# Altium schematic sheet 07-PowerManagement.SchDoc: Power Management
size A2; DocumentNumber: 7; SheetNumber: 7; SheetTotal: 15
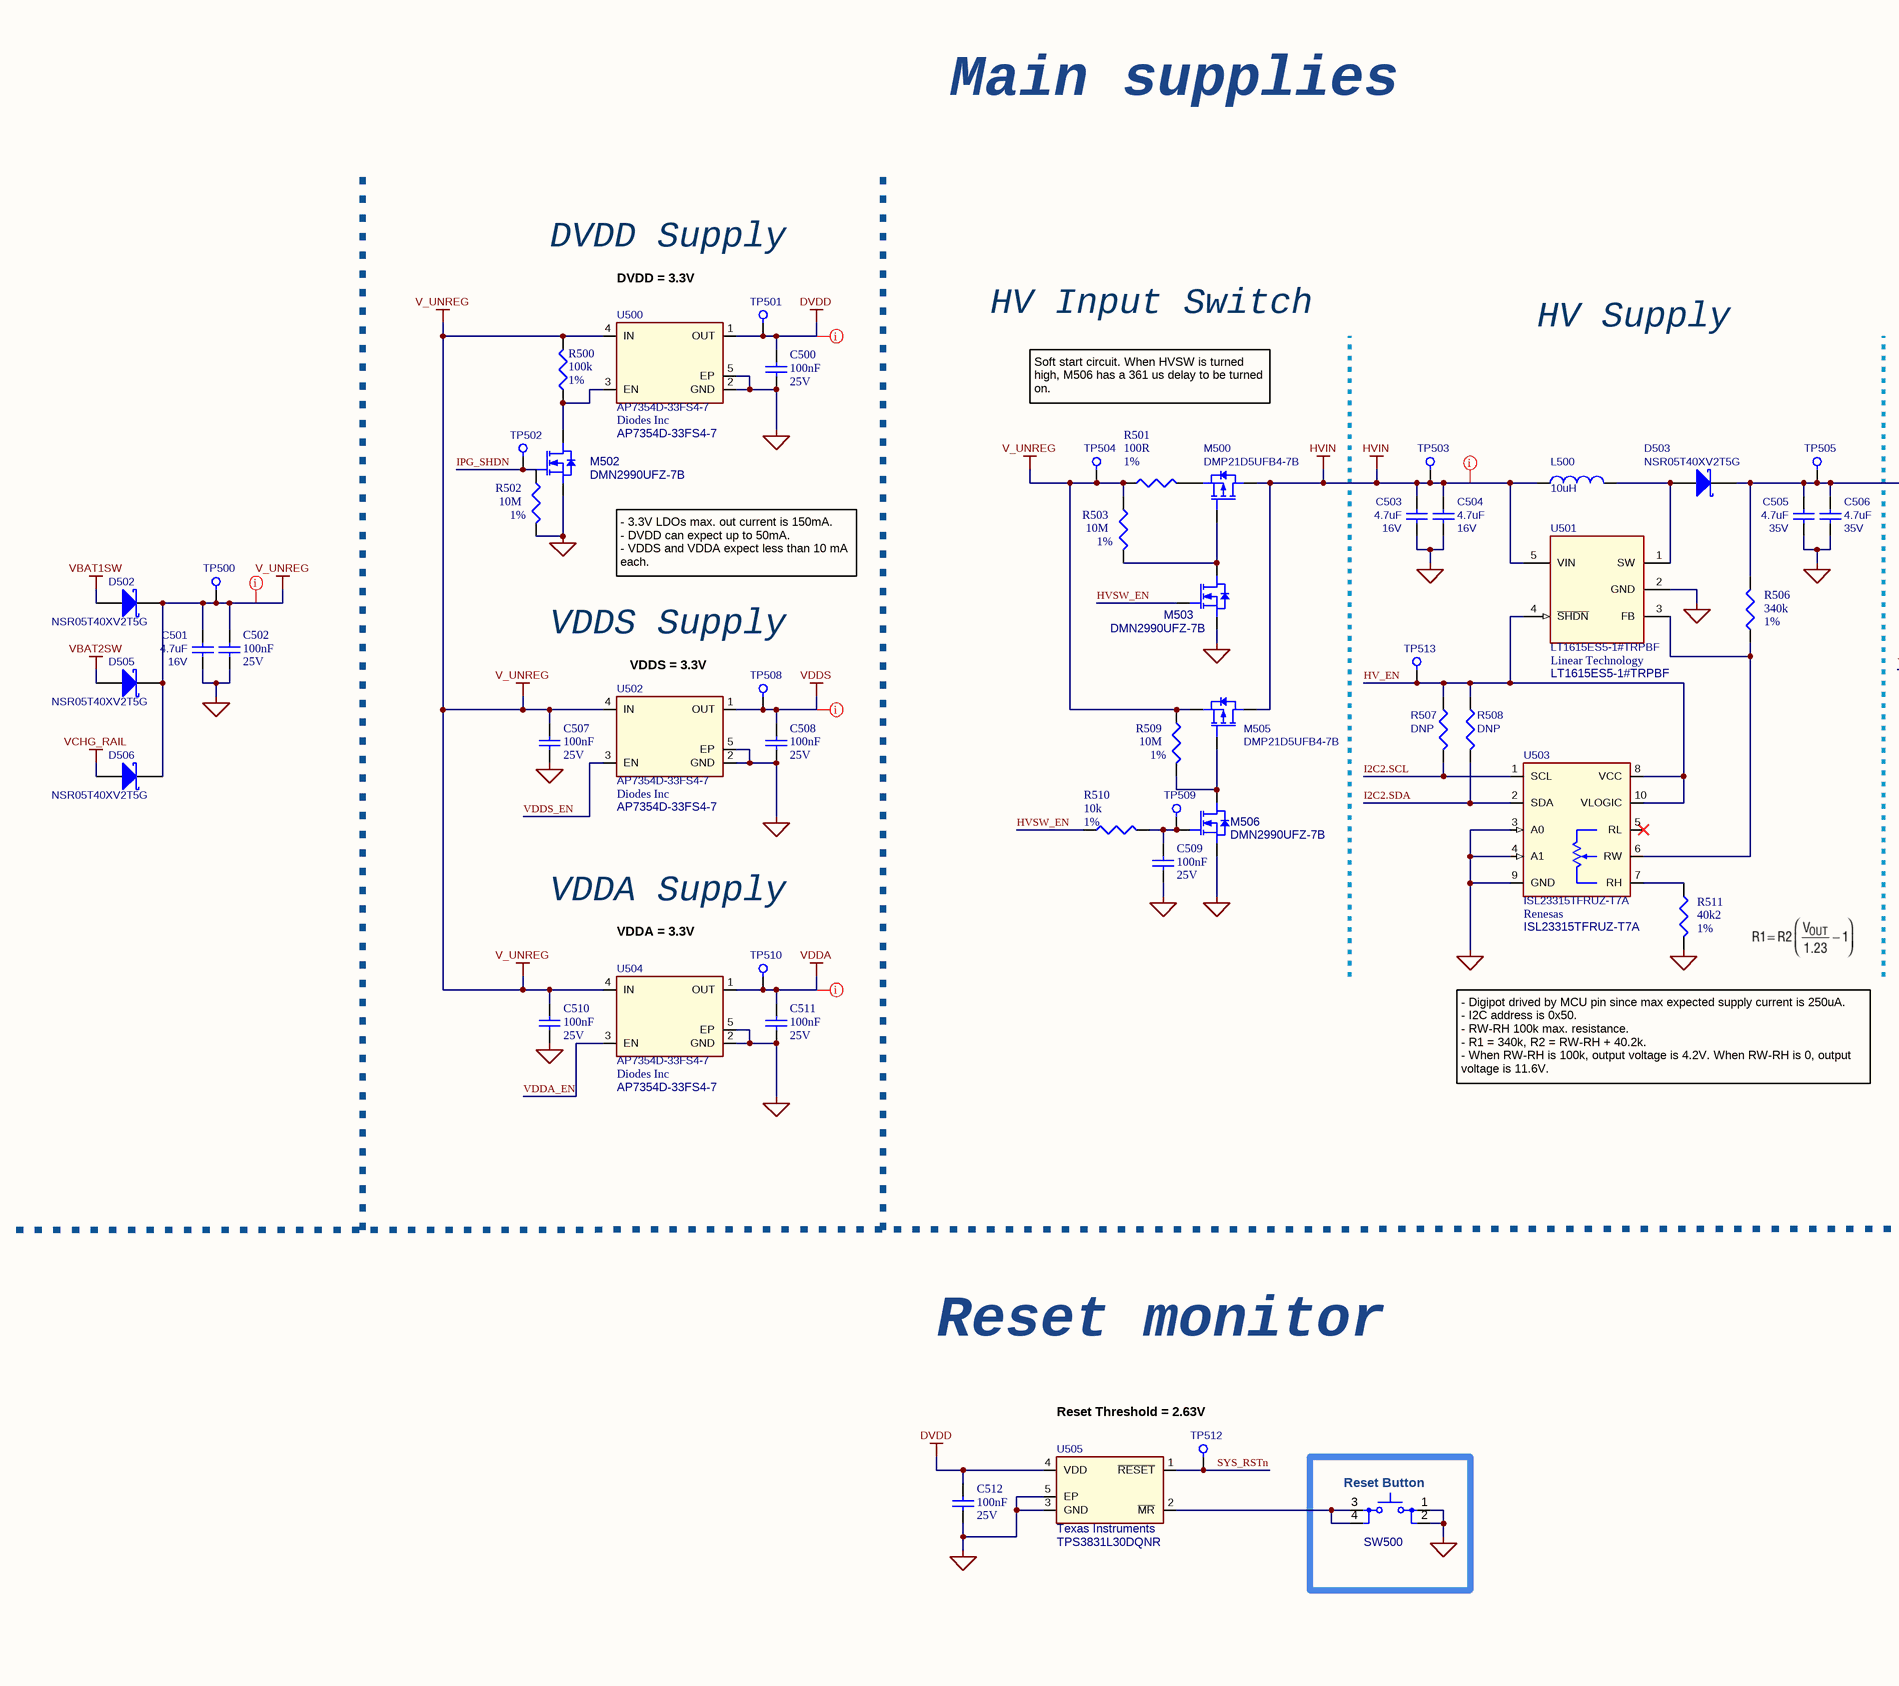
[diagram p0: 07-PowerManagement.SchDoc, left]
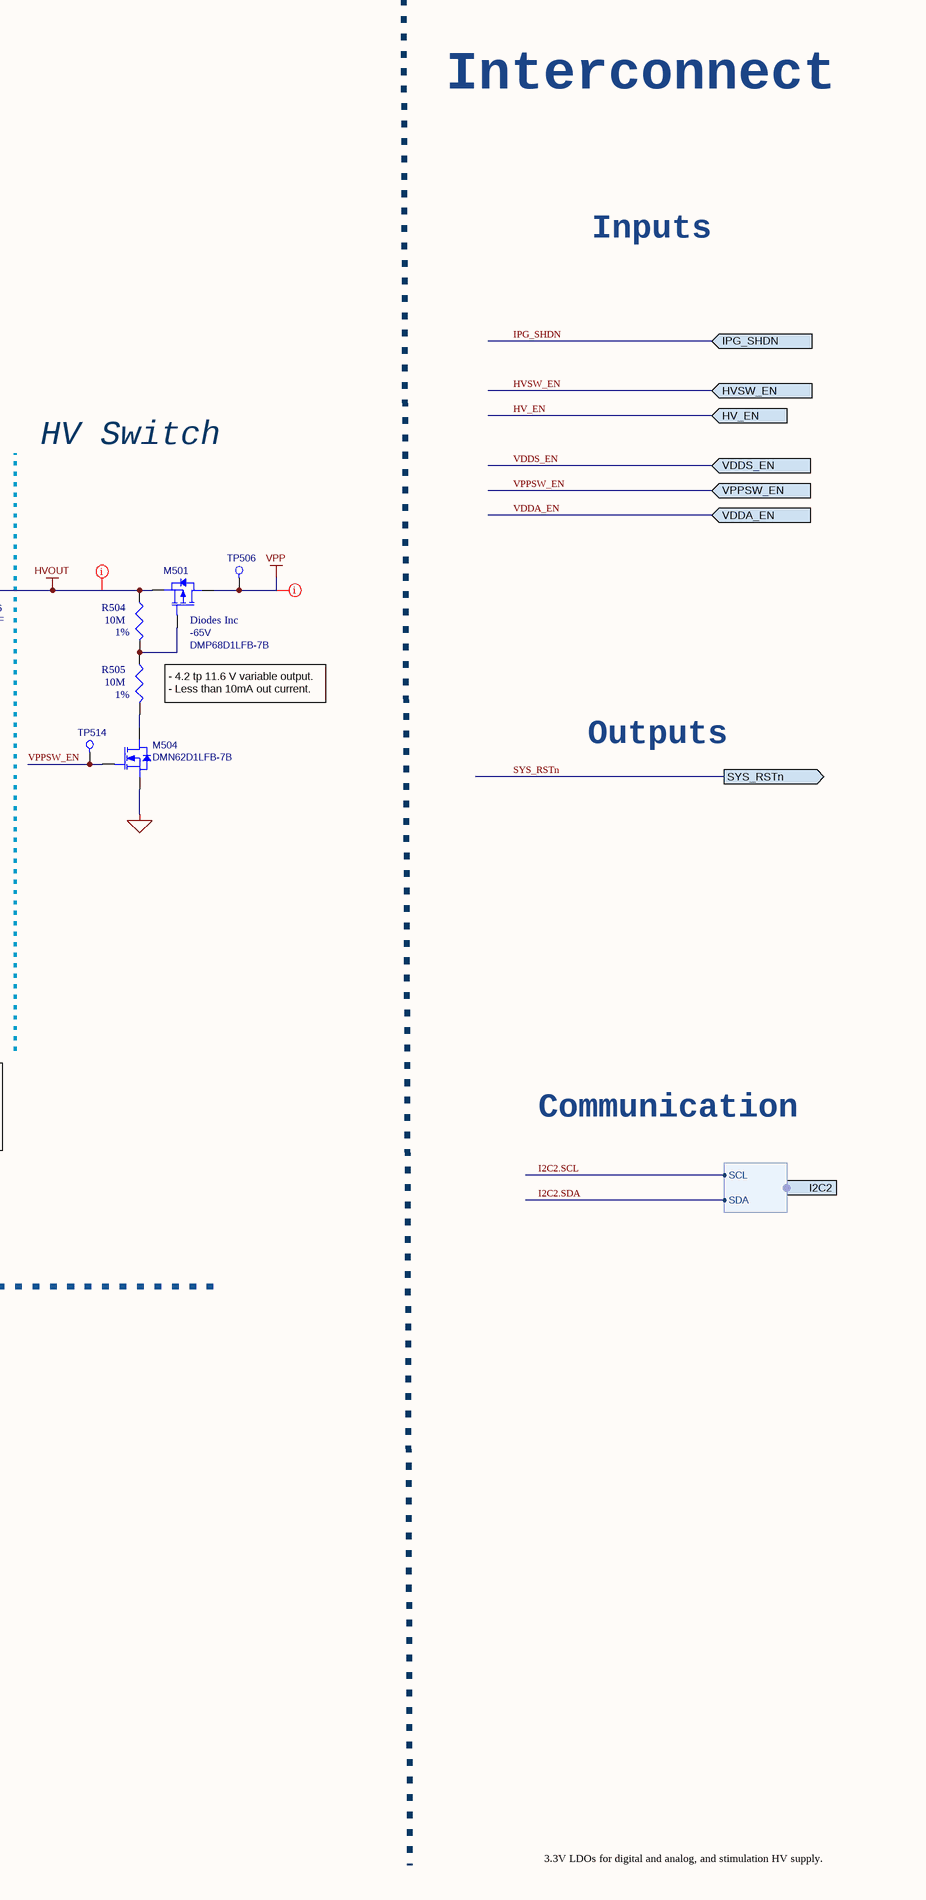
[diagram p1: 07-PowerManagement.SchDoc, right]

## Parts
C500  value 100nF  Rated DC Voltage (URdc): 25V  [C0201_C]  (hidden comment: GRM033R61E104KE14J)
C501  value 4.7uF  Rating: 16V  [CAP0603_REDUCED]  (hidden comment: GRM188R61C475KE11)
C502  value 100nF  Rated DC Voltage (URdc): 25V  [C0201_C]  (hidden comment: GRM033R61E104KE14J)
C503  value 4.7uF  Rating: 16V  [CAP0603_REDUCED]  (hidden comment: GRM188R61C475KE11)
C504  value 4.7uF  Rating: 16V  [CAP0603_REDUCED]  (hidden comment: GRM188R61C475KE11)
C505  value 4.7uF  Rating: 35V  [CAP0805_REDUCED]  (hidden comment: GCM21BC7YA475KE36L)
C506  value 4.7uF  Rating: 35V  [CAP0805_REDUCED]  (hidden comment: GCM21BC7YA475KE36L)
C507  value 100nF  Rated DC Voltage (URdc): 25V  [C0201_C]  (hidden comment: GRM033R61E104KE14J)
C508  value 100nF  Rated DC Voltage (URdc): 25V  [C0201_C]  (hidden comment: GRM033R61E104KE14J)
C509  value 100nF  Rated DC Voltage (URdc): 25V  [C0201_C]  (hidden comment: GRM033R61E104KE14J)
C510  value 100nF  Rated DC Voltage (URdc): 25V  [C0201_C]  (hidden comment: GRM033R61E104KE14J)
C511  value 100nF  Rated DC Voltage (URdc): 25V  [C0201_C]  (hidden comment: GRM033R61E104KE14J)
C512  value 100nF  Rated DC Voltage (URdc): 25V  [C0201_C]  (hidden comment: GRM033R61E104KE14J)
D502  NSR05T40XV2T5G  [STM_SOD-523_R]
D503  NSR05T40XV2T5G  [STM_SOD-523_R]
D505  NSR05T40XV2T5G  [STM_SOD-523_R]
D506  NSR05T40XV2T5G  [STM_SOD-523_R]
L500  value 10uH  [WURTH_74438323100_REDUCED]  (hidden comment: 74438323100)
M500  DMP21D5UFB4-7B  [DIODESINC_X2-DFN1006-3_REDUCED]
M501  Manufacturer: Diodes Inc  Rating: -65V  [DIODESINC_X1-DFN1006-3]  (hidden comment: DMP68D1LFB-7B)
M502  DMN2990UFZ-7B  [DIODESINC_X2-DFN0606-3]
M503  DMN2990UFZ-7B  [DIODESINC_X2-DFN0606-3]
M504  DMN62D1LFB-7B  [DIODESINC_X1-DFN1006-3]
M505  DMP21D5UFB4-7B  [DIODESINC_X2-DFN1006-3_REDUCED]
M506  DMN2990UFZ-7B  [DIODESINC_X2-DFN0606-3]
R500  value 100k  Tolerance: 1%  [R0201_C]  (hidden comment: CRCW0201100KFNED)
R501  value 100R  Tolerance: 1%  [R0201_C]  (hidden comment: CRCW0201100RFNED)
R502  value 10M  Tolerance: 1%  [R0201_C]  (hidden comment: CRCW020110M0FNED)
R503  value 10M  Tolerance: 1%  [R0201_C]  (hidden comment: CRCW020110M0FNED)
R504  value 10M  Tolerance: 1%  [R0201_C]  (hidden comment: CRCW020110M0FNED)
R505  value 10M  Tolerance: 1%  [R0201_C]  (hidden comment: CRCW020110M0FNED)
R506  value 340k  Tolerance: 1%  [R0201_C]  (hidden comment: CRCW0201340KFKED)
R507  value DNP  [RES0402_REDUCED]  (hidden comment: Resistor, DNP, 0402)
R508  value DNP  [RES0402_REDUCED]  (hidden comment: Resistor, DNP, 0402)
R509  value 10M  Tolerance: 1%  [R0201_C]  (hidden comment: CRCW020110M0FNED)
R510  value 10k  Tolerance: 1%  [R0201_C]  (hidden comment: CRCW020110K0FNED)
R511  value 40k2  Tolerance: 1%  [R0201_C]  (hidden comment: CRCW020140K2FNED)
SW500  PB  [CK_PTS647]  (value not drawn)
TP500  Test Point  [testpad_0.9mm]  (value not drawn)  (no BOM)
TP501  Test Point  [testpad_0.9mm]  (value not drawn)  (no BOM)
TP502  Test Point  [testpad_0.9mm]  (value not drawn)  (no BOM)
TP503  Test Point  [testpad_0.9mm]  (value not drawn)  (no BOM)
TP504  Test Point  [testpad_0.9mm]  (value not drawn)  (no BOM)
TP505  Test Point  [testpad_0.9mm]  (value not drawn)  (no BOM)
TP506  Test Point  [testpad_0.9mm]  (value not drawn)  (no BOM)
TP508  Test Point  [testpad_0.9mm]  (value not drawn)  (no BOM)
TP509  Test Point  [testpad_0.9mm]  (value not drawn)  (no BOM)
TP510  Test Point  [testpad_0.9mm]  (value not drawn)  (no BOM)
TP512  Test Point  [testpad_0.9mm]  (value not drawn)  (no BOM)
TP513  Test Point  [testpad_0.9mm]  (value not drawn)  (no BOM)
TP514  Test Point  [testpad_0.9mm]  (value not drawn)  (no BOM)
U500  AP7354D-33FS4-7  Manufacturer: Diodes Inc  [X2-DFN1010-4 (Type B)]
U501  LT1615ES5-1#TRPBF  Manufacturer: Linear Technology  [LT_S5_L]
U502  AP7354D-33FS4-7  Manufacturer: Diodes Inc  [X2-DFN1010-4 (Type B)]
U503  ISL23315TFRUZ-T7A  Manufacturer: Renesas  [RENESAS_L10.2.1X1.6A_UTQFN10]
U504  AP7354D-33FS4-7  Manufacturer: Diodes Inc  [X2-DFN1010-4 (Type B)]
U505  Manufacturer: Texas Instruments  [TI_X2SON_DQN0004A]  (hidden comment: TPS3831L30DQNR)

## Ports
HV_EN (in), HVSW_EN (in), I2C2 (harness I2C), IPG_SHDN (in), SYS_RSTn (out), VDDA_EN (in), VDDS_EN (in), VPPSW_EN (in)

## Harnesses
I2C: SDA, SCL

## Nets
DVDD: C500.2 C512.2 TP501.1 U500.1(OUT) U505.4(VDD)
GND: C500.1 C501.2 C502.1 C503.2 C504.2 C505.2 C506.2 C507.1 C508.1 C509.1 C510.1 C511.1 C512.1 M502.2(S) M503.2(S) M504.2(S) M506.2(S) R502.2 R511.2 SW500.1 SW500.2 U500.2(GND) U500.5(EP) U501.2(GND) U502.2(GND) U502.5(EP) U503.3(A0) U503.4(A1) U503.9(GND) U504.2(GND) U504.5(EP) U505.3(GND) U505.5(EP)
HVIN: C503.1 C504.1 L500.1 M500.3(D) M505.3(D) TP503.1 U501.5(VIN)
HVOUT: C505.1 C506.1 D503.1(K) M501.2(S) R504.1 R506.2 TP505.1
V_UNREG: C501.1 C502.2 C507.2 C510.2 D502.1(K) D505.1(K) D506.1(K) M505.2(S) R500.2 R501.1 R503.1 R509.1 TP500.1 TP504.1 U500.4(IN) U502.4(IN) U504.4(IN)
VBAT1SW: D502.2(A)
VBAT2SW: D505.2(A)
VCHG_RAIL: D506.2(A)
VDDA: C511.2 TP510.1 U504.1(OUT)
VDDS: C508.2 TP508.1 U502.1(OUT)
VPP: M501.3(D) TP506.1
HV_EN: R507.1 R508.1 TP513.1 U501.4(~{SHDN}) U503.8(VCC) U503.10(VLOGIC) ; port HV_EN
HVSW_EN: M503.1(G) R510.1 ; port HVSW_EN
I2C2.SCL: R507.2 U503.1(SCL) ; port I2C2.SCL
I2C2.SDA: R508.2 U503.2(SDA) ; port I2C2.SDA
IPG_SHDN: M502.1(G) R502.1 TP502.1 ; port IPG_SHDN
SYS_RSTn: TP512.1 U505.1(~{RESET}) ; port SYS_RSTn
VDDA_EN: U504.3(EN) ; port VDDA_EN
VDDS_EN: U502.3(EN) ; port VDDS_EN
VPPSW_EN: M504.1(G) TP514.1 ; port VPPSW_EN
NetC509_2: C509.2 M506.1(G) R510.2 TP509.1
NetD503_2: D503.2(A) L500.2 U501.1(SW)
NetM500_1: M500.1(G) M503.3(D) R503.2
NetM500_2: M500.2(S) R501.2
NetM501_1: M501.1(G) R504.2 R505.1
NetM502_3: M502.3(D) R500.1 U500.3(EN)
NetM504_3: M504.3(D) R505.2
NetM505_1: M505.1(G) M506.3(D) R509.2
NetR506_1: R506.1 U501.3(FB) U503.6(RW)
NetR511_1: R511.1 U503.7(RH)
NetSW500_3: SW500.3 SW500.4 U505.2(~{MR})

Not connected (* = marked no-connect by the designer): U503 5(RL)*

## Layout directives
rule Supply Nets [Voltage = 3.300]; net class POWER: DVDD, VDDA, VDDS
Voltage: 4.2-11.6V: VPP
net class POWER; Voltage: 2.8-5.0V: HVIN, V_UNREG
net class POWER; Voltage: 4.2-11.6V: HVOUT

## Notes on the sheet
- Interconnect
- Main supplies
- Inputs
- DVDD Supply
- DVDD = 3.3V
- HV Input Switch
- HV Supply
- HV Switch
- Soft start circuit. When HVSW is turned high, M506 has a 361 us delay to be turned on.
- - 3.3V LDOs max. out current is 150mA.
  - DVDD can expect up to 50mA.
  - VDDS and VDDA expect less than 10 mA each.
- VDDS Supply
- - 4.2 tp 11.6 V variable output.
  - Less than 10mA out current.
- Outputs
- VDDS = 3.3V
- VDDA Supply
- VDDA = 3.3V
- Communication
- - Digipot drived by MCU pin since max expected supply current is 250uA.
  - I2C address is 0x50.
  - RW-RH 100k max. resistance.
  - R1 = 340k, R2 = RW-RH + 40.2k.
  - When RW-RH is 100k, output voltage is 4.2V. When RW-RH is 0, output voltage is 11.6V.
- Reset monitor
- Reset Threshold = 2.63V
- (near SW500) Reset Button
- 3.3V LDOs for digital and analog, and stimulation HV supply.
- Project:
- Schematic:
- Design by:
- Date:
- Ver:
- .
- Comments:
- Reviewed by:

## Library data of the parts
C500 C502 C507-C512 = GRM033R61E104KE14J: Ceramic Capacitor, Multilayer, Ceramic, 25V, 10% +Tol, 10% -Tol, X5R, 15% TC, 0.1uF, Surface Mount, 0201; Manufacturer: Murata; Multilayer: Yes; Category: Ceramic Capacitors; Supplier: Digikey; Supplier Part Number: 490-14571-1-ND; Manufacturer Part Number: GRM033R61E104KE14J; RoHS: Yes; Stock: 1540851; Pricing: 1=0,1, 10=0,033, 50=0,0192, 100=0,0148, 500=0,01118, 1000=0,00878, 2500=0,00798, 5000=0,00734 (USD); Mounting Technology: Surface Mount; Pins: 2; Dielectric Material: Ceramic; Package Shape: Rectangular; Case/Package: 0201; Terminal Finish: Nickel; Min Operating Temperature: -55°C; Max Operating Temperature: 85°C; JESD-609 Code: e3; Capacitor Type: Ceramic; Tolerance  (fill in as +-): 10%; Package Style: SMTMeter; Packaging: Tape and Reel; Tolerance (fill in as +-): 10%; Temperature Characteristics Code: X5R; Termination: Wraparound; Length: 0.6mm; Width: 0.3mm; Height: 0.3mm; Reach SVHC Compliant: Yes; RoHS Compliant: Yes; ComponentLink1URL: https://psearch.en.murata.com:443/capacitor/product/GRM033R61E104KE14%23.pdf?src-supplier=IHS+Markit; ComponentLink1Description: https://psearch.en.murata.com:443/capacitor/product/GRM033R61E104KE14%23.pdf?src-supplier=IHS+Markit; ComponentLink2URL: http://www.mouser.com/ds/2/281/c02e-2905.pdf?src-supplier=Mouser; ComponentLink2Description: http://www.mouser.com/ds/2/281/c02e-2905.pdf?src-supplier=Mouser; ComponentLink3URL: http://search.murata.co.jp/Ceramy/image/img/A01X/G101/ENG/GRM033R61E104KE14-01.pdf?src-supplier=Digikey; ComponentLink3Description: http://search.murata.co.jp/Ceramy/image/img/A01X/G101/ENG/GRM033R61E104KE14-01.pdf?src-supplier=Digikey; ComponentLink4URL: https://search.murata.co.jp/Ceramy/image/img/A01X/G101/ENG/GRM033R61E104KE14-01.pdf?src-supplier=Digikey; ComponentLink4Description: https://search.murata.co.jp/Ceramy/image/img/A01X/G101/ENG/GRM033R61E104KE14-01.pdf?src-supplier=Digikey; Supplier 1: Arrow Electronics; Supplier Part Number 1: GRM033R61E104KE14J
C501 C503 C504 = GRM188R61C475KE11: Capacitor, 4.7uF, X5R, 16V, 10%, 0603, Implant-grade; Manufacturer: Murata; Medical Grade MFR PN: GCH188R61C475KE11; Length (mm): 1.60 ±0.10; Medical Grade MFR: Murata; PCB Footprint: cap0603_reduced; Thickness (mm): 0.80 ±0.10; Width (mm): 0.80 ±0.10; Category: Capacitor; Package Description: 0603; Check: *; Supplier 1: Arrow Electronics; Supplier Part Number 1: GRM188R61C475KE11D; Status: *; Review: *; Manufacturer Part Number: GRM188R61C475KE11
C505 C506 = GCM21BC7YA475KE36L: Capacitor, 4.7uF, X7S, 35V, 10%, 0805, Implant-grade; Manufacturer: Murata; Medical Grade MFR PN: GCH21BC7YA475KE11; Review: 020823; Length (mm): 2.00 ±0.20; Medical Grade MFR: Murata; PCB Footprint: cap0805_reduced; Thickness (mm): 1.25 ±0.20; Width (mm): 1.25 ±0.20; Category: Capacitor; Package Description: 0805; Check: *; Supplier 1: Arrow Electronics; Supplier Part Number 1: GCM21BC7YA475KE36L; Status: Approved; Manufacturer Part Number: GCM21BC7YA475KE36L
D502 D503 D505 D506 = NSR05T40XV2T5G: Schottky, 40V, 500mA, 530mV, SOD-523; Manufacturer: ON Semiconductor; Medical Grade MFR: TBD; Review: 020823; Length (mm): 1.60 ±0.10; Medical Grade MFR PN: TBD; PCB Footprint: TBD; Rating: 40V, 500mA; Thickness (mm): 0.60 ±0.10; Value: NSR05T40XV2T5G; Width (mm): 0.80 ±0.10; Category: Diode; Supplier 1: Arrow Electronics; Supplier Part Number 1: NSR05T40XV2T5G; Status: Approved; Manufacturer Part Number: NSR05T40XV2T5G
L500 = 74438323100: Inductor, 10uH, 600mA, 20%, 1008; Manufacturer: Wurth; Medical Grade MFR: TBD; Review: 020823; Length (mm): 2.50 ±0.20; Medical Grade MFR PN: TBD; PCB Footprint: TBD; Rating: 600mA; Thickness (mm): 1.00; Width (mm): 2.00 ±0.20; Category: Inductor; Supplier 1: Rs; Supplier Part Number 1: 7922736P; Status: Approved; Manufacturer Part Number: 74438323100
M500 M505 = DMP21D5UFB4-7B: MOSFET, P-chan, -20V, -400mA, X2-DFN1006-3; Manufacturer: Diodes Inc; Medical Grade MFR: TBD; Review: 020823; Category: Transistor; Length (mm): 1.00 ±0.05; Medical Grade MFR PN: TBD; Rating: -20V; Thickness (mm): 0.40; Width (mm): 0.60 ±0.05; Value: DMP21D5UFB4-7B; Supplier 1: Digi-Key; Supplier Part Number 1: DMP21D5UFB4-7BDICT-ND; Status: Approved; Manufacturer Part Number: DMP21D5UFB4-7B
M501 = DMP68D1LFB-7B: MOSFET, P-chan, -65V, -290mA, DFN1006; Medical Grade MFR: TBD; Review: 020823; Category: Transistor; Length (mm): 1.00 ±0.08; Medical Grade MFR PN: TBD; PCB Footprint: DFN1006; Thickness (mm): 0.50 ±0.03; Width (mm): 0.60 ±0.08; Supplier 1: Mouser; Supplier Part Number 1: 621-DMP68D1LFB-7B; Value: DMP68D1LFB-7B; Manufacturer Part Number: DMP68D1LFB
M502 M503 M506 = DMN2990UFZ-7B: MOSFET, N-Chan, 20V, 170mA, DFN0606; Manufacturer: Diodes Inc; Medical Grade MFR: TBD; Review: 020823; Category: Transistor; Length (mm): 0.62 ±0.05; Medical Grade MFR PN: TBD; PCB Footprint: TBD; Rating: 20V; Thickness (mm): 0.38 ±0.02; Value: DMN2990UFZ-7B; Width (mm): 0.62 ±0.05; Supplier 1: Digi-Key; Supplier Part Number 1: DMN2990UFZ-7BDICT-ND; Status: Approved; Manufacturer Part Number: DMN2990UFZ-7B
M504 = DMN62D1LFB-7B: MOSFET, N-Chan, 60V, 320mA, DFN1006; Manufacturer: Diodes Inc; Medical Grade MFR: TBD; Review: 020823; Category: Transistor; Length (mm): 1.00 ±0.08; Medical Grade MFR PN: TBD; PCB Footprint: TBD; Rating: 60V; Thickness (mm): 0.50 ±0.03; Width (mm): 0.60 ±0.08; Value: DMN62D1LFB-7B; Supplier 1: Digi-Key; Supplier Part Number 1: DMN62D1LFB-7BDICT-ND; Status: Approved; Manufacturer Part Number: DMN62D1LFB-7B
R500 = CRCW0201100KFNED: Fixed Resistor, Metal Glaze/thick Film, 0.05W, 100000ohm, 30V, 1% +/-Tol, 200ppm/Cel, Surface Mount, 0201; Manufacturer: Vishay; Medical Grade MFR: Mini-Systems; Medical Grade MFR PN: MWA96SM-1003F-NS62TR; Power: 50mW; Rated Temperature: 70°C; Temperature Coefficient: 200ppm/°C; Package Height: 0.23mm; Package Length: 0.6mm; Package Width: 0.3mm; Reference Standard: AEC-Q200; Category: Chip SMD Resistors; Supplier: Digikey; Supplier Part Number: 541-100KABCT-ND; Manufacturer Part Number: CRCW0201100KFNED; RoHS: Yes; Stock: 8252; Pricing: 1=0,1, 10=0,037, 50=0,0242, 100=0,0204, 500=0,01426, 1000=0,01241, 5000=0,00924 (USD); Mounting Technology: Surface Mount; Pins: 2; Package Shape: Rectangular; Case/Package: 0201; Terminal Finish: Nickel; Min Operating Temperature: -55°C; Max Operating Temperature: 155°C; JESD-609 Code: e3; Resistor Type: FIXED RESISTOR; Construction: Chip; Package Style: SMTMeter; Packaging: Tape and Reel; Technology: METAL GLAZE/THICK FILM; Termination: Wraparound; Working Voltage: 30V; Reach SVHC Compliant: Yes; RoHS Compliant: Yes; ComponentLink1URL: https://datasheet.ciiva.com:443/pdfs/VipMasterIC/IC/VISH/VISH-S-A0002932828/VISH-S-A0002932828-1.pdf?src-supplier=IHS+Markit; ComponentLink1Description: https://datasheet.ciiva.com:443/pdfs/VipMasterIC/IC/VISH/VISH-S-A0002932828/VISH-S-A0002932828-1.pdf?src-supplier=IHS+Markit; ComponentLink2URL: https://datasheet.ciiva.com/2474/crcw0201e3-2474797.pdf?src-supplier=Digikey; ComponentLink2Description: https://datasheet.ciiva.com/2474/crcw0201e3-2474797.pdf?src-supplier=Digikey; ComponentLink3URL: https://datasheet.ciiva.com/2474/crcw0201e3-2474798.pdf?src-supplier=Digikey; ComponentLink3Description: https://datasheet.ciiva.com/2474/crcw0201e3-2474798.pdf?src-supplier=Digikey; ComponentLink4URL: https://datasheet.ciiva.com/2474/crcw0201e3-2474799.pdf?src-supplier=Digikey; ComponentLink4Description: https://datasheet.ciiva.com/2474/crcw0201e3-2474799.pdf?src-supplier=Digikey; ComponentLink5URL: https://datasheet.ciiva.com/16436/dcrcwe3-16436220.pdf?src-supplier=Future+Electronics; ComponentLink5Description: https://datasheet.ciiva.com/16436/dcrcwe3-16436220.pdf?src-supplier=Future+Electronics; ComponentLink6URL: https://datasheet.ciiva.com/28634/1847332-28634462.pdf?src-supplier=Element14; ComponentLink6Description: https://datasheet.ciiva.com/28634/1847332-28634462.pdf?src-supplier=Element14; ComponentLink7URL: https://datasheet.ciiva.com/22665/1700795-22665689.pdf?src-supplier=Element14; ComponentLink7Description: https://datasheet.ciiva.com/22665/1700795-22665689.pdf?src-supplier=Element14; ComponentLink8URL: https://datasheet.ciiva.com/22870/70202042-22870476.pdf?src-supplier=Allied+Electronics; ComponentLink8Description: https://datasheet.ciiva.com/22870/70202042-22870476.pdf?src-supplier=Allied+Electronics; ComponentLink9URL: https://datasheet.ciiva.com/16777/70202042-16777655.pdf?src-supplier=Allied+Electronics; ComponentLink9Description: https://datasheet.ciiva.com/16777/70202042-16777655.pdf?src-supplier=Allied+Electronics; Supplier 1: Digikey; Supplier Part Number 1: 541-100KABCT-ND
R501 = CRCW0201100RFNED: Fixed Resistor, Metal Glaze/thick Film, 0.05W, 100ohm, 30V, 1% +/-Tol, 200ppm/Cel, Surface Mount, 0201; Manufacturer: Vishay; Medical Grade MFR: Mini-Systems; Medical Grade MFR PN: MWA96SM-1000F-NS62TR; Power: 50mW; Rated Temperature: 70°C; Temperature Coefficient: 200ppm/°C; Package Height: 0.23mm; Package Length: 0.6mm; Package Width: 0.3mm; Reference Standard: AEC-Q200; Category: Chip SMD Resistors; Supplier: Digikey; Supplier Part Number: 541-100ABCT-ND; Manufacturer Part Number: CRCW0201100RFNED; RoHS: Yes; Stock: 52904; Pricing: 1=0,1, 10=0,037, 50=0,0242, 100=0,0204, 500=0,01426, 1000=0,01241, 5000=0,00924 (USD); Mounting Technology: Surface Mount; Pins: 2; Package Shape: Rectangular; Terminal Finish: Nickel; Case/Package: 0201; Min Operating Temperature: -55°C; Max Operating Temperature: 155°C; JESD-609 Code: e3; Package Style: SMTMeter; Technology: METAL GLAZE/THICK FILM; Resistor Type: FIXED RESISTOR; Construction: Chip; Packaging: Tape and Reel; Termination: Wraparound; Working Voltage: 30V; Reach SVHC Compliant: Yes; RoHS Compliant: Yes; ComponentLink1URL: https://datasheet.ciiva.com:443/pdfs/VipMasterIC/IC/VISH/VISH-S-A0002932828/VISH-S-A0002932828-1.pdf?src-supplier=IHS+Markit; ComponentLink1Description: https://datasheet.ciiva.com:443/pdfs/VipMasterIC/IC/VISH/VISH-S-A0002932828/VISH-S-A0002932828-1.pdf?src-supplier=IHS+Markit; ComponentLink2URL: https://datasheet.ciiva.com/8083/crcw0201e3-8083961.pdf?src-supplier=Avnet; ComponentLink2Description: https://datasheet.ciiva.com/8083/crcw0201e3-8083961.pdf?src-supplier=Avnet; ComponentLink3URL: https://datasheet.ciiva.com/2527/crcw0201e3-2527593.pdf?src-supplier=Digikey; ComponentLink3Description: https://datasheet.ciiva.com/2527/crcw0201e3-2527593.pdf?src-supplier=Digikey; ComponentLink4URL: https://datasheet.ciiva.com/2527/crcw0201e3-2527591.pdf?src-supplier=Digikey; ComponentLink4Description: https://datasheet.ciiva.com/2527/crcw0201e3-2527591.pdf?src-supplier=Digikey; ComponentLink5URL: https://datasheet.ciiva.com/2527/crcw0201e3-2527592.pdf?src-supplier=Digikey; ComponentLink5Description: https://datasheet.ciiva.com/2527/crcw0201e3-2527592.pdf?src-supplier=Digikey; ComponentLink6URL: https://datasheet.ciiva.com/7983/1719906-7983317.pdf?src-supplier=Element14; ComponentLink6Description: https://datasheet.ciiva.com/7983/1719906-7983317.pdf?src-supplier=Element14; ComponentLink7URL: https://datasheet.ciiva.com/7983/1719906-7983318.pdf?src-supplier=Element14; ComponentLink7Description: https://datasheet.ciiva.com/7983/1719906-7983318.pdf?src-supplier=Element14; ComponentLink8URL: https://datasheet.ciiva.com/16757/70202042-16757607.pdf?src-supplier=Allied+Electronics; ComponentLink8Description: https://datasheet.ciiva.com/16757/70202042-16757607.pdf?src-supplier=Allied+Electronics; ComponentLink9URL: https://datasheet.ciiva.com/16202/dcrcwe3-16202605.pdf?src-supplier=Future+Electronics; ComponentLink9Description: https://datasheet.ciiva.com/16202/dcrcwe3-16202605.pdf?src-supplier=Future+Electronics; ComponentLink10URL: https://datasheet.ciiva.com/22665/1700795-22665690.pdf?src-supplier=Element14; ComponentLink10Description: https://datasheet.ciiva.com/22665/1700795-22665690.pdf?src-supplier=Element14; Supplier 1: Digikey; Supplier Part Number 1: 541-100ABCT-ND
R502-R505 R509 = CRCW020110M0FNED: Fixed Resistor, Metal Glaze/thick Film, 0.05W, 10000000ohm, 30V, 1% +/-Tol, 200ppm/Cel, Surface Mount, 0201; Manufacturer: Vishay Draloric; Medical Grade MFR: Mini-Systems; Medical Grade MFR PN: MWA96SM-1005F-NS62TR; Power: 50mW; Rated Temperature: 70°C; Temperature Coefficient: 200ppm/°C; Category: Chip SMD Resistors; Supplier: Mouser; Supplier Part Number: 71-CRCW020110M0FNED; Manufacturer Part Number: CRCW020110M0FNED; RoHS: Yes; Stock: 159754; Pricing: 1=0,1, 10=0,024, 50=0,024, 100=0,014, 1000=0,011, 10000=0,006 (USD); Mounting Technology: Surface Mount; Pins: 2; Package Shape: Rectangular; Case/Package: 0201; Terminal Finish: Nickel; Min Operating Temperature: -55°C; Max Operating Temperature: 155°C; JESD-609 Code: e3; Resistor Type: FIXED RESISTOR; Packaging: Tape and Reel; Technology: METAL GLAZE/THICK FILM; Termination: Wraparound; Working Voltage: 30V; Reach SVHC Compliant: Yes; RoHS Compliant: Yes; ComponentLink1URL: https://datasheet.ciiva.com:443/pdfs/VipMasterIC/IC/VISH/VISH-S-A0002932828/VISH-S-A0002932828-1.pdf?src-supplier=IHS+Markit; ComponentLink1Description: https://datasheet.ciiva.com:443/pdfs/VipMasterIC/IC/VISH/VISH-S-A0002932828/VISH-S-A0002932828-1.pdf?src-supplier=IHS+Markit; ComponentLink2URL: https://datasheet.ciiva.com/7673/1719906-7673177.pdf?src-supplier=Element14; ComponentLink2Description: https://datasheet.ciiva.com/7673/1719906-7673177.pdf?src-supplier=Element14; ComponentLink3URL: https://datasheet.ciiva.com/7673/1719906-7673178.pdf?src-supplier=Element14; ComponentLink3Description: https://datasheet.ciiva.com/7673/1719906-7673178.pdf?src-supplier=Element14; ComponentLink4URL: https://datasheet.ciiva.com/22692/1719906-22692711.pdf?src-supplier=Element14; ComponentLink4Description: https://datasheet.ciiva.com/22692/1719906-22692711.pdf?src-supplier=Element14; ComponentLink5URL: https://datasheet.ciiva.com/22665/1700795-22665701.pdf?src-supplier=Element14; ComponentLink5Description: https://datasheet.ciiva.com/22665/1700795-22665701.pdf?src-supplier=Element14; Supplier 1: Digikey; Supplier Part Number 1: 541-CRCW020110M0FNEDCT-ND
R506 = CRCW0201340KFKED: Fixed Resistor, Metal Glaze/thick Film, 0.05W, 340000ohm, 30V, 1% +/-Tol, 200ppm/Cel, Surface Mount, 0201; Manufacturer: Vishay; Medical Grade MFR: Mini-Systems; Medical Grade MFR PN: MWA96SM-3403F-NS62TR; Power: 50mW; Rated Temperature: 70°C; Temperature Coefficient: 200ppm/°C; Package Height: 0.23mm; Package Length: 0.6mm; Package Width: 0.3mm; Reference Standard: AEC-Q200; Supplier: Digikey; Supplier Part Number: 541-340KAABDKR-ND; Manufacturer Part Number: CRCW0201340KFKED; RoHS: Yes; Category: Chip SMD Resistors; Pricing: 1=0,1, 10=0,037, 50=0,0242, 100=0,0204, 500=0,01426, 1000=0,01241, 5000=0,00924 (USD); Mounting Technology: Surface Mount; Pins: 2; Package Shape: Rectangular; Case/Package: 0201; Terminal Finish: Nickel; Min Operating Temperature: -55°C; Max Operating Temperature: 155°C; JESD-609 Code: e3; Resistor Type: FIXED RESISTOR; Construction: Chip; Package Style: SMTMeter; Packaging: Tape and Reel; Technology: METAL GLAZE/THICK FILM; Termination: Wraparound; Working Voltage: 30V; Reach SVHC Compliant: Yes; RoHS Compliant: Yes; ComponentLink1URL: https://datasheet.ciiva.com:443/pdfs/VipMasterIC/IC/VISH/VISH-S-A0002932828/VISH-S-A0002932828-1.pdf?src-supplier=IHS+Markit; ComponentLink1Description: https://datasheet.ciiva.com:443/pdfs/VipMasterIC/IC/VISH/VISH-S-A0002932828/VISH-S-A0002932828-1.pdf?src-supplier=IHS+Markit; ComponentLink2URL: https://datasheet.ciiva.com/2577/crcw0201e3-2577344.pdf?src-supplier=Digikey; ComponentLink2Description: https://datasheet.ciiva.com/2577/crcw0201e3-2577344.pdf?src-supplier=Digikey; ComponentLink3URL: https://datasheet.ciiva.com/8944/crcw0201e3-8944076.pdf?src-supplier=Avnet; ComponentLink3Description: https://datasheet.ciiva.com/8944/crcw0201e3-8944076.pdf?src-supplier=Avnet; ComponentLink4URL: https://datasheet.ciiva.com/7673/1719906-7673960.pdf?src-supplier=Element14; ComponentLink4Description: https://datasheet.ciiva.com/7673/1719906-7673960.pdf?src-supplier=Element14; ComponentLink5URL: https://datasheet.ciiva.com/7673/1719906-7673961.pdf?src-supplier=Element14; ComponentLink5Description: https://datasheet.ciiva.com/7673/1719906-7673961.pdf?src-supplier=Element14; ComponentLink6URL: https://datasheet.ciiva.com/22706/1719906-22706187.pdf?src-supplier=Element14; ComponentLink6Description: https://datasheet.ciiva.com/22706/1719906-22706187.pdf?src-supplier=Element14; ComponentLink7URL: https://datasheet.ciiva.com/22675/1700795-22675861.pdf?src-supplier=Element14; ComponentLink7Description: https://datasheet.ciiva.com/22675/1700795-22675861.pdf?src-supplier=Element14; Supplier 1: Digikey; Supplier Part Number 1: 541-340KAABCT-ND
R507 R508 = RES_DNP_0402: Review: 020823; Length (mm): 1.12 ±0.10; Manufacturer: N/A; Manufacturer PN: N/A; Medical Grade MFR: N/A; Medical Grade MFR PN: N/A; PCB Footprint: res0402_reduced; Rating: N/A; Thickness (mm): 0.33 ±0.08; Width (mm): 0.56 ±0.08; Category: Resistor; Status: Approved
R510 = CRCW020110K0FNED: Fixed Resistor, Metal Glaze/thick Film, 0.05W, 10000ohm, 30V, 1% +/-Tol, 200ppm/Cel, Surface Mount, 0201; Manufacturer: Vishay; Medical Grade MFR: Mini-Systems; Medical Grade MFR PN: MWA96SM-1002F-NS62TR; Power: 50mW; Rated Temperature: 70°C; Temperature Coefficient: 200ppm/°C; Package Height: 0.23mm; Package Length: 0.6mm; Package Width: 0.3mm; Reference Standard: AEC-Q200; Category: Chip SMD Resistors; Supplier: Digikey; Supplier Part Number: 541-10.0KABCT-ND; Manufacturer Part Number: CRCW020110K0FNED; RoHS: Yes; Stock: 1011530; Pricing: 1=0,1, 10=0,037, 50=0,0242, 100=0,0204, 500=0,01426, 1000=0,01241, 5000=0,00924 (USD); Mounting Technology: Surface Mount; Pins: 2; Package Shape: Rectangular; Case/Package: 0201; Terminal Finish: Nickel; Min Operating Temperature: -55°C; Max Operating Temperature: 155°C; JESD-609 Code: e3; Resistor Type: FIXED RESISTOR; Construction: Chip; Package Style: SMTMeter; Packaging: Tape and Reel; Technology: METAL GLAZE/THICK FILM; Termination: Wraparound; Working Voltage: 30V; Reach SVHC Compliant: Yes; RoHS Compliant: Yes; ComponentLink1URL: https://datasheet.ciiva.com:443/pdfs/VipMasterIC/IC/VISH/VISH-S-A0002932828/VISH-S-A0002932828-1.pdf?src-supplier=IHS+Markit; ComponentLink1Description: https://datasheet.ciiva.com:443/pdfs/VipMasterIC/IC/VISH/VISH-S-A0002932828/VISH-S-A0002932828-1.pdf?src-supplier=IHS+Markit; ComponentLink2URL: https://datasheet.ciiva.com/2474/crcw0201e3-2474819.pdf?src-supplier=Digikey; ComponentLink2Description: https://datasheet.ciiva.com/2474/crcw0201e3-2474819.pdf?src-supplier=Digikey; ComponentLink3URL: https://datasheet.ciiva.com/2474/crcw0201e3-2474820.pdf?src-supplier=Digikey; ComponentLink3Description: https://datasheet.ciiva.com/2474/crcw0201e3-2474820.pdf?src-supplier=Digikey; ComponentLink4URL: https://datasheet.ciiva.com/2474/crcw0201e3-2474818.pdf?src-supplier=Digikey; ComponentLink4Description: https://datasheet.ciiva.com/2474/crcw0201e3-2474818.pdf?src-supplier=Digikey; ComponentLink5URL: https://datasheet.ciiva.com/16436/dcrcwe3-16436222.pdf?src-supplier=Future+Electronics; ComponentLink5Description: https://datasheet.ciiva.com/16436/dcrcwe3-16436222.pdf?src-supplier=Future+Electronics; ComponentLink6URL: https://datasheet.ciiva.com/7983/1719906-7983320.pdf?src-supplier=Element14; ComponentLink6Description: https://datasheet.ciiva.com/7983/1719906-7983320.pdf?src-supplier=Element14; ComponentLink7URL: https://datasheet.ciiva.com/7983/1719906-7983319.pdf?src-supplier=Element14; ComponentLink7Description: https://datasheet.ciiva.com/7983/1719906-7983319.pdf?src-supplier=Element14; ComponentLink8URL: https://datasheet.ciiva.com/22692/1719906-22692709.pdf?src-supplier=Element14; ComponentLink8Description: https://datasheet.ciiva.com/22692/1719906-22692709.pdf?src-supplier=Element14; Supplier 1: Mouser; Supplier Part Number 1: 71-CRCW0201-10K
R511 = CRCW020140K2FNED: Fixed Resistor, Metal Glaze/thick Film, 0.05W, 40200ohm, 30V, 1% +/-Tol, 200ppm/Cel, Surface Mount, 0201; Manufacturer: Vishay; Medical Grade MFR: Mini-Systems; Medical Grade MFR PN: MWA96SM-4022F-NS62TR; Power: 50mW; Rated Temperature: 70°C; Temperature Coefficient: 200ppm/°C; Package Height: 0.23mm; Package Length: 0.6mm; Package Width: 0.3mm; Reference Standard: AEC-Q200; Category: Chip SMD Resistors; Supplier: Digikey; Supplier Part Number: 541-CRCW020140K2FNEDCT-ND; Manufacturer Part Number: CRCW020140K2FNED; RoHS: Yes; Stock: 24960; Pricing: 1=0,1, 10=0,037, 50=0,0242, 100=0,0204, 500=0,01426, 1000=0,01241, 5000=0,00924 (USD); Mounting Technology: Surface Mount; Pins: 2; Package Shape: Rectangular; Case/Package: 0201; Terminal Finish: Nickel; Min Operating Temperature: -55°C; Max Operating Temperature: 155°C; JESD-609 Code: e3; Resistor Type: FIXED RESISTOR; Construction: Chip; Package Style: SMTMeter; Packaging: Tape and Reel; Technology: METAL GLAZE/THICK FILM; Termination: Wraparound; Working Voltage: 30V; Reach SVHC Compliant: Yes; RoHS Compliant: Yes; ComponentLink1URL: https://datasheet.ciiva.com:443/pdfs/VipMasterIC/IC/VISH/VISH-S-A0002932828/VISH-S-A0002932828-1.pdf?src-supplier=IHS+Markit; ComponentLink1Description: https://datasheet.ciiva.com:443/pdfs/VipMasterIC/IC/VISH/VISH-S-A0002932828/VISH-S-A0002932828-1.pdf?src-supplier=IHS+Markit; ComponentLink2URL: https://datasheet.ciiva.com/7671/1719906-7671543.pdf?src-supplier=Element14; ComponentLink2Description: https://datasheet.ciiva.com/7671/1719906-7671543.pdf?src-supplier=Element14; ComponentLink3URL: https://datasheet.ciiva.com/7671/1719906-7671544.pdf?src-supplier=Element14; ComponentLink3Description: https://datasheet.ciiva.com/7671/1719906-7671544.pdf?src-supplier=Element14; ComponentLink4URL: https://datasheet.ciiva.com/2577/crcw0201e3-2577288.pdf?src-supplier=Digikey; ComponentLink4Description: https://datasheet.ciiva.com/2577/crcw0201e3-2577288.pdf?src-supplier=Digikey; ComponentLink5URL: https://datasheet.ciiva.com/6000/1719906-6000661.pdf?src-supplier=Farnell; ComponentLink5Description: https://datasheet.ciiva.com/6000/1719906-6000661.pdf?src-supplier=Farnell; ComponentLink6URL: https://datasheet.ciiva.com/22705/1719906-22705803.pdf?src-supplier=Element14; ComponentLink6Description: https://datasheet.ciiva.com/22705/1719906-22705803.pdf?src-supplier=Element14; Supplier 1: Digikey; Supplier Part Number 1: 541-CRCW020140K2FNEDCT-ND
SW500 = PTS647SN50SMTR2LFS: Pushbutton, NO-MOM, 12V, 0.05A, SMT; Manufacturer: C&K; Category: Pushbutton; Length (mm): 6.5 ±0.20; Rating: 12V,0.05A; Thickness (mm): 1.55 ±0.15; Width (mm): 4.5; Supplier 1: Digi-Key; Supplier Part Number 1: PTS647SN50SMTR2LFSCT-ND; Package Description: SMT; Status: *; Review: *; Manufacturer Part Number: PTS647SN50SMTR2LFS
TP500-TP506 TP508-TP510 TP512-TP514 = Test Point: Test pad, 0.90mm circular pad; PCB Footprint: testpad_0p90mm; Length (mm): 0.90; Manufacturer: N/A; Manufacturer PN: N/A; Medical Grade MFR: N/A; Medical Grade MFR PN: N/A; Rating: N/A; Thickness (mm): N/A; Value: Test point; Width (mm): 0.90; Category: Test point; Status: *; Review: *
U500 U502 U504 = AP7354D-33FS4-7: LDO Regulator, 3.3V, Shutdown, DFN1010-4; Medical Grade MFR: TBD; Length (mm): 1.00 ±0.05; Medical Grade MFR PN: TBD; PCB Footprint: TBD; Rating: 3.3V; Thickness (mm): 0.39 ±0.01; Value: AP7354D-33FS4-7; Width (mm): 1.00 ±0.05; Category: IC; Package Description: TBD; Supplier 1: Digi-Key; Supplier Part Number 1: AP7354D-33FS4-7DICT-ND; Supplier Link: https://octopart.com/search?q=AP7354D-33FS4-7&filter%5Bfields%5D%5Bbrand.name%5D%5B%5D=Diodes+Inc.4-7; Status: *; Review: *; Manufacturer Part Number: AP7354D-33FS4-7
U501 = LT1615ES5-1#TRPBF: Boost, SEPIC Switching Regulator IC Positive Adjustable 1.23V 1 Output 75mA (Switch) SOT-23-5; Medical Grade MFR: TBD; Rating: 100 mA; Category: IC; Length (mm): 2.80 ±0.20; Medical Grade MFR PN: TBD; Package Description: TBD; PCB Footprint: TBD; Thickness (mm): 1.00; Value: LT1615ES5-1#TRPBF; Width (mm): 2.95 ±0.15; Supplier 1: Digi-Key; Supplier Part Number 1: 505-LT1615ES5-1#TRPBFCT-ND; Status: *; Review: *; Manufacturer Part Number: LT1615ES5-1#TRPBF
U503 = ISL23315TFRUZ-T7A: Digital potentiometer, 256 taps, 100k, I2C, QFN-10; Medical Grade MFR: TBD; Category: IC; Length (mm): 2.10; Medical Grade MFR PN: TBD; Package Description: TBD; PCB Footprint: TBD; Rating: TBD; Thickness (mm): 0.55; Value: ISL23315TFRUZ-T7A; Width (mm): 1.60; Supplier 1: Digi-Key; Supplier Part Number 1: ISL23315TFRUZ-T7ACT-ND; Status: *; Review: *; Manufacturer Part Number: ISL23315TFRUZ-T7A
U505 = TPS3831L30DQNR: Reset Monitor, 2.63V, Active low, X2SON; Medical Grade MFR: TBD; Category: IC; Length (mm): 1.00 ±0.05; Medical Grade MFR PN: TBD; PCB Footprint: TBD; Rating: N/A; Thickness (mm): 0.40; Value: TPS3831L30DQNR; Width (mm): 1.00 ±0.05; Package Description: TBD; Supplier 1: Digi-Key; Supplier Part Number 1: 296-40754-1-ND; Status: *; Review: *; Manufacturer Part Number: TPS3831L30DQNR